# Altium project CGRA_Board_2.PrjPcb (part 3 of 3)

## Sheet TPSM846C23_template.SchDoc
size B; Organization: Altium Limited; Address1: L3, 12a Rodborough Rd; Address2: Frenchs Forest; Address3: NSW; Address4: Australia 2086
Used 2 times, as channels U_Power_subsystem/U_TPSM846C23_template, U_Power_subsystem/U_TPSM846C23_template. Parts and nets are listed once, with the designators drawn on the sheet.
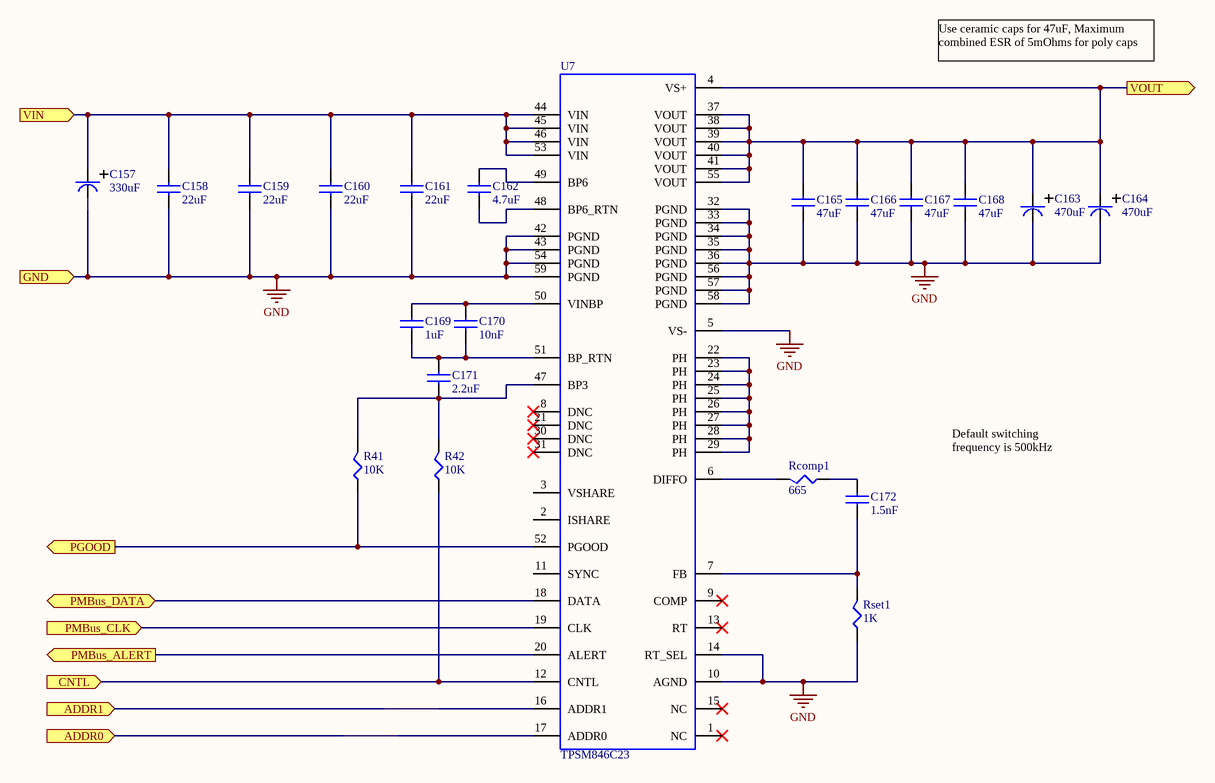
[diagram p11: TPSM846C23_template.SchDoc]

### Parts
C157  Capacitance: 330uF  [CAPAE110103X127M]  (hidden comment: CAP_POLY_330uF_25V)
C158  Capacitance: 22uF  [CAPC4532X28N]  (hidden comment: CAP_22uF_1812_25V)
C159  Capacitance: 22uF  [CAPC4532X28N]  (hidden comment: CAP_22uF_1812_25V)
C160  Capacitance: 22uF  [CAPC4532X28N]  (hidden comment: CAP_22uF_1812_25V)
C161  Capacitance: 22uF  [CAPC4532X28N]  (hidden comment: CAP_22uF_1812_25V)
C162  Capacitance: 4.7uF  [CAPC2012X14N]  (hidden comment: CAP_4.7uF_0805_25V)
C163  Capacitance: 470uF  [CAPAE110103X127M]  (hidden comment: CAP_POLY_470uF_16V)
C164  Capacitance: 470uF  [CAPAE110103X127M]  (hidden comment: CAP_POLY_470uF_16V)
C165  Capacitance: 47uF  [CAPC2012X14N]  (hidden comment: CAP_47uF_0805_10V)
C166  Capacitance: 47uF  [CAPC2012X14N]  (hidden comment: CAP_47uF_0805_10V)
C167  Capacitance: 47uF  [CAPC2012X14N]  (hidden comment: CAP_47uF_0805_10V)
C168  Capacitance: 47uF  [CAPC2012X14N]  (hidden comment: CAP_47uF_0805_10V)
C169  Capacitance: 1uF  [CAPC2012X14N]  (hidden comment: CAP_1uF_0805_25V)
C170  Capacitance: 10nF  [CAPC1005X06N]  (hidden comment: CAP_10nF_0402_25V)
C171  Capacitance: 2.2uF  [CAPC1005X06N]  (hidden comment: CAP_2.2uF_0402_25V)
C172  Capacitance: 1.5nF  [CAPC0603X02N]  (hidden comment: CAP_1500pF_0201_25V)
R41  Resistance: 10K  [RESC1608X06N]  (hidden comment: RES_10K_0603)
R42  Resistance: 10K  [RESC1608X06N]  (hidden comment: RES_10K_0603)
Rcomp1  Resistance: 665  [RESC1608X06N]  (hidden comment: RES_665_0603)
Rset1  Resistance: 1K  [RESC1608X06N]  (hidden comment: RES_1K_0603)
U7  TPSM846C23  [QFM-59]

### Ports
ADDR0 (in), ADDR1 (in), CNTL (in), GND (in), PGOOD (out), PMBus_ALERT (out), PMBus_CLK (in), PMBus_DATA (bidir), VIN (in), VOUT (out)

### Nets
GND: C157.2 C158.2 C159.2 C160.2 C161.2 C163.2 C164.2 C165.2 C166.2 C167.2 C168.2 Rset1.2 U7.5(VS-) U7.10(AGND) U7.14(RT_SEL) U7.32(PGND) U7.33(PGND) U7.34(PGND) U7.35(PGND) U7.36(PGND) U7.42(PGND) U7.43(PGND) U7.54(PGND) U7.56(PGND) U7.57(PGND) U7.58(PGND) U7.59(PGND) ; port GND
ADDR0: U7.17(ADDR0) ; port ADDR0
ADDR1: U7.16(ADDR1) ; port ADDR1
CNTL: R42.2 U7.12(CNTL) ; port CNTL
PGOOD: R41.2 U7.52(PGOOD) ; port PGOOD
PMBus_ALERT: U7.20(ALERT) ; port PMBus_ALERT
PMBus_CLK: U7.19(CLK) ; port PMBus_CLK
PMBus_DATA: U7.18(DATA) ; port PMBus_DATA
VIN: C157.1 C158.1 C159.1 C160.1 C161.1 U7.44(VIN) U7.45(VIN) U7.46(VIN) U7.53(VIN) ; port VIN
VOUT: C163.1 C164.1 C165.1 C166.1 C167.1 C168.1 U7.4(VS+) U7.37(VOUT) U7.38(VOUT) U7.39(VOUT) U7.40(VOUT) U7.41(VOUT) U7.55(VOUT) ; port VOUT
NetC162_1: C162.1 U7.49(BP6)
NetC162_2: C162.2 U7.48(BP6_RTN)
NetC169_1: C169.1 C170.1 U7.50(VINBP)
NetC169_2: C169.2 C170.2 C171.1 U7.51(BP_RTN)
NetC171_2: C171.2 R41.1 R42.1 U7.47(BP3)
NetC172_1: C172.1 Rcomp1.2
NetC172_2: C172.2 Rset1.1 U7.7(FB)
NetRcomp1_1: Rcomp1.1 U7.6(DIFFO)
NetU7_22: U7.22(PH) U7.23(PH) U7.24(PH) U7.25(PH) U7.26(PH) U7.27(PH) U7.28(PH) U7.29(PH)

Not connected (* = marked no-connect by the designer): U7 1(NC)* 2(ISHARE) 3(VSHARE) 8(DNC)* 9(COMP)* 11(SYNC) 13(RT)* 15(NC)* 21(DNC)* 30(DNC)* 31(DNC)*

### Channels
U_Power_subsystem/U_TPSM846C23_template: designators end in _U_Power_subsystem_U_TPSM846C23_template#1; ports ADDR0=NetR34_2 ADDR1=NetR33_2 CNTL=PMBUS_CNTL GND=GND PGOOD=NetDS2_2 PMBus_ALERT=ALERT0 PMBus_CLK=PICO_MASTER_I2C_SCL PMBus_DATA=PICO_MASTER_I2C_SDA VIN=12V VOUT=0V8_INT
U_Power_subsystem/U_TPSM846C23_template: designators end in _U_Power_subsystem_U_TPSM846C23_template#2; ports ADDR0=NetR37_2 ADDR1=NetR36_2 CNTL=PMBUS_CNTL GND=GND PGOOD=NetDS3_2 PMBus_ALERT=ALERTIO PMBus_CLK=PICO_MASTER_I2C_SCL PMBus_DATA=PICO_MASTER_I2C_SDA VIN=12V VOUT=1V8_PSM_INT

### Notes on the sheet
- Use ceramic caps for 47uF, Maximum combined ESR of 5mOhms for poly caps
- Default switching frequency is 500kHz
- Title
- Size:
- Date:
- B
- Number:
- Time:
- Revision:
- Sheet
- of
- File:

### Library data of the parts
C157 = CAP_POLY_330uF_25V: SML-D12U1WT86TR-ND; Manufacturer: Panasonic; Manufacturer Part Number: 25SVF330M; Supplier 1: Digi-Key; Stock 1: 639; Pricing 1: 1=2.78, 10=2.247, 100=1.716 (USD); Supplier Part Number 1: P122120CT-ND
C158-C161 = CAP_22uF_1812_25V: CAP CER 22UF 25V X7R 1812; Manufacturer: TDK; Manufacturer Part Number: C4532X7R1E226M250KC; Dielectric Material: Ceramic; Tolerance: 20%; ComponentLink1URL: http://search.murata.co.jp/Ceramy/image/img/A01X/G101/ENG/GRM0335C1E120JA01-01.pdf; ComponentLink1Description: http://search.murata.co.jp/Ceramy/image/img/A01X/G101/ENG/GRM0335C1E120JA01-01.pdf; ComponentLink2URL: http://search.murata.co.jp/Ceramy/image/img/A01X/partnumbering_e_01.pdf; ComponentLink2Description: http://search.murata.co.jp/Ceramy/image/img/A01X/partnumbering_e_01.pdf; ComponentLink3URL: http://www1.futureelectronics.com/doc/SAMSUNG/CL03A104KQ3NNNC.pdf; ComponentLink3Description: http://www1.futureelectronics.com/doc/SAMSUNG/CL03A104KQ3NNNC.pdf; ComponentLink4URL: https://www.distrelec.biz/Web/Downloads/_e/ng/MLCC_CatalogDownload2013_ENG.pdf?mime=application%2Fpdf; ComponentLink4Description: https://www.distrelec.biz/Web/Downloads/_e/ng/MLCC_CatalogDownload2013_ENG.pdf?mime=application%2Fpdf; ComponentLink5URL: https://www.verical.com/server-webapp/html/getDatasheet?partID=355266; ComponentLink5Description: https://www.verical.com/server-webapp/html/getDatasheet?partID=355266; Supplier 1: Digi-Key; Stock 1: 5000; Pricing 1: 1=1.29, 10=0.981, 100=0.7019 (USD); Mount: Surface Mount; Case/Package: 1812; Number of Pins: 2; Weight: 0.000952oz; Case Code (Metric): 4532; Case Code (Imperial): 1812; Min Operating Temperature: -55°C; Max Operating Temperature: 125°C; Packaging: Tape and Reel; Package Quantity: 1; Termination: SMD/SMT; Voltage Rating: 25V; Voltage Rating (DC): 25V; Dielectric: X7R; Composition: Ceramic; Voltage: 25V; Length: 4.5mm; Height: 2.5mm; Width: 0.126inch; Thickness: 0.11inch; Depth: 3.2mm; Radiation Hardening: No; REACH SVHC: No SVHC; Lead Free: Lead Free; ComponentLink6URL: http://uk.rs-online.com/webdocs/1532/0900766b81532cd0.pdf; ComponentLink6Description: http://uk.rs-online.com/webdocs/1532/0900766b81532cd0.pdf; ComponentLink7URL: http://www.farnell.com/datasheets/1796654.pdf; ComponentLink7Description: http://www.farnell.com/datasheets/1796654.pdf; ComponentLink8URL: https://product.tdk.com/info/en/documents/chara_sheet/C4532X7R1E226M250KC.pdf; ComponentLink8Description: https://product.tdk.com/info/en/documents/chara_sheet/C4532X7R1E226M250KC.pdf; ComponentLink9URL: http://www.mouser.com/ds/2/400/lcc_commercial_general_en-837201.pdf; ComponentLink9Description: http://www.mouser.com/ds/2/400/lcc_commercial_general_en-837201.pdf; Supplier Part Number 1: 445-1607-1-ND
C162 = CAP_4.7uF_0805_25V: Cap Ceramic 4.7uF 25V X5R 10% SMD 0805 85C Cardboard T/R; Manufacturer: Samsung; Manufacturer Part Number: CL21A475KACLRNC; Supplier 1: Digi-Key; Stock 1: 10785; Pricing 1: 1=0.25, 10=0.171, 100=0.0867, 500=0.05932, 1000=0.05247 (USD); Mount: Surface Mount; Case/Package: 0805; Case Code (Metric): 2012; Case Code (Imperial): 0805; Min Operating Temperature: -55°C; Max Operating Temperature: 85°C; Package Quantity: 1; Packaging: Tape and Reel; Tolerance: 10%; Voltage Rating: 25V; Dielectric: X5R; Length: 2mm; Height: 0.85mm; Width: 0.049inch; Thickness: 0.037inch; Depth: 1.25mm; Radiation Hardening: No; ComponentLink1URL: http://www.samsungsem.com/kr/support/product-search/mlcc/CL21A475KACLRNC.jsp; ComponentLink1Description: http://www.samsungsem.com/kr/support/product-search/mlcc/CL21A475KACLRNC.jsp; Supplier Part Number 1: 1276-2415-1-ND
C163 C164 = CAP_POLY_470uF_16V: CAP POLYMER 470UF 20% 16V SMD; Manufacturer: Panasonic; Manufacturer Part Number: 25SVF330M; ESR (Equivalent Series Resistance): 10mR; Ripple Current: 6.1A; Leakage Current: 1.504mA; Polarity: Polar; Life (Hours): 2000Hour; Dissipation Factor: 12%; Supplier 1: Digi-Key; Stock 1: 6872; Pricing 1: 1=2.66, 10=2.147, 100=1.6399 (USD); Mount: Surface Mount; Case/Package: Radial; Number of Pins: 12; Min Operating Temperature: -55°C; Max Operating Temperature: 105°C; Tolerance: 20%; Packaging: Tape and Reel; Voltage Rating: 16V; Voltage Rating (DC): 16V; Package Quantity: 400; Ripple Current (AC): 6.1A; Termination: SMD/SMT; Voltage: 16V; Diameter: 10mm; Length: 12.6mm; Height: 12.6mm; Height - Seated (Max): 0.5inch; Radiation Hardening: No; REACH SVHC: No SVHC; Lead Free: Lead Free; ComponentLink1URL: https://www.verical.com/server-webapp/html/getDatasheet?partID=743667; ComponentLink1Description: https://www.verical.com/server-webapp/html/getDatasheet?partID=743667; ComponentLink2URL: http://www.farnell.com/datasheets/1734359.pdf; ComponentLink2Description: http://www.farnell.com/datasheets/1734359.pdf; ComponentLink3URL: http://www.farnell.com/datasheets/2059644.pdf; ComponentLink3Description: http://www.farnell.com/datasheets/2059644.pdf; Supplier Part Number 1: P16477CT-ND
C165-C168 = CAP_47uF_0805_10V: Cap Ceramic 47uF 10V X5R 20% SMD 0805 85C Embossed T/R; Manufacturer: Murata; Manufacturer Part Number: GRM21BR61A476ME15L; Dissipation Factor: 0.035%; ComponentLink1URL: http://www.samsungsem.com/kr/support/product-search/mlcc/CL21A475KACLRNC.jsp; ComponentLink1Description: http://www.samsungsem.com/kr/support/product-search/mlcc/CL21A475KACLRNC.jsp; ComponentLink2URL: http://capacitoredge.kemet.com/capedge2/DataSheet?pn=C0805C105K3RAC7800; ComponentLink2Description: http://capacitoredge.kemet.com/capedge2/DataSheet?pn=C0805C105K3RAC7800; Supplier 1: Digi-Key; Stock 1: 30000; Pricing 1: 1=0.93, 10=0.687, 100=0.4713, 500=0.37308, 1000=0.31418 (USD); Mount: Surface Mount; Case/Package: 0805; Case Code (Metric): 2012; Case Code (Imperial): 0805; Dielectric Material: Ceramic; Min Operating Temperature: -55°C; Max Operating Temperature: 85°C; Tolerance: 20%; Packaging: Tape and Reel; Dielectric: X5R; Voltage Rating: 10V; Voltage: 10V; Termination: SMD/SMT; Voltage Rating (DC): 10V; Length: 2mm; Height: 1.25mm; Width: 0.049inch; Thickness: 0.057inch; Depth: 1.25mm; REACH SVHC: No SVHC; Lead Free: Lead Free; Supplier Part Number 1: 490-9961-1-ND
C169 = CAP_1uF_0805_25V: CAP CER 1UF 25V X7R 0805; Manufacturer: Yageo; Manufacturer Part Number: CC0805KKX7R8BB105; Tolerance: 10%; Dissipation Factor: 5%; ComponentLink1URL: http://www.samsungsem.com/kr/support/product-search/mlcc/CL21A475KACLRNC.jsp; ComponentLink1Description: http://www.samsungsem.com/kr/support/product-search/mlcc/CL21A475KACLRNC.jsp; Supplier 1: Digi-Key; Stock 1: 30000; Pricing 1: 1=0.33, 10=0.226, 100=0.1145, 500=0.07832, 1000=0.06928 (USD); Mount: Surface Mount; Case/Package: 0805; Min Operating Temperature: -55°C; Max Operating Temperature: 125°C; Packaging: Tape and Reel; Dielectric: X7R; Termination: SMD/SMT; Length: 2mm; Radiation Hardening: No; ComponentLink2URL: http://capacitoredge.kemet.com/capedge2/DataSheet?pn=C0805C105K3RAC7800; ComponentLink2Description: http://capacitoredge.kemet.com/capedge2/DataSheet?pn=C0805C105K3RAC7800; Supplier Part Number 1: 311-1456-1-ND; Case Code (Metric): 2012; Case Code (Imperial): 0805; Package Quantity: 3000; Voltage Rating: 25V; Voltage Rating (DC): 25V; Width: 0.049inch; Thickness: 0.057inch; REACH SVHC: No SVHC; Number of Pins: 2; Composition: Ceramic; Height: 1.25mm; Depth: 1.25mm; Lead Free: Lead Free; Halogen Free: Halogen Free; ComponentLink3URL: http://www.yageo.com/documents/recent/UPY-GPHC_X7R_6.3V-to-50V_18.pdf; ComponentLink3Description: http://www.yageo.com/documents/recent/UPY-GPHC_X7R_6.3V-to-50V_18.pdf; ComponentLink4URL: http://www.mouser.com/ds/2/447/Yageo_UPY-GP_NP0_16V-to-50V_9-358835.pdf; ComponentLink4Description: http://www.mouser.com/ds/2/447/Yageo_UPY-GP_NP0_16V-to-50V_9-358835.pdf; ComponentLink5URL: http://www.yageo.com/documents/recent/UPY-GPHC_X7R_6.3V-to-50V_8.pdf; ComponentLink5Description: http://www.yageo.com/documents/recent/UPY-GPHC_X7R_6.3V-to-50V_8.pdf; ComponentLink6URL: http://www.farnell.com/datasheets/1489800.pdf; ComponentLink6Description: http://www.farnell.com/datasheets/1489800.pdf
C170 = CAP_10nF_0402_25V: CAP CER 10000PF 50V X7R 0402; Manufacturer: Murata; Manufacturer Part Number: GCM155R71H103KA55D; Tolerance: 10%; ComponentLink1URL: http://search.murata.co.jp/Ceramy/image/img/A01X/G101/ENG/GRM0335C1E120JA01-01.pdf; ComponentLink1Description: http://search.murata.co.jp/Ceramy/image/img/A01X/G101/ENG/GRM0335C1E120JA01-01.pdf; ComponentLink2URL: http://search.murata.co.jp/Ceramy/image/img/A01X/partnumbering_e_01.pdf; ComponentLink2Description: http://search.murata.co.jp/Ceramy/image/img/A01X/partnumbering_e_01.pdf; ComponentLink3URL: http://www1.futureelectronics.com/doc/SAMSUNG/CL03A104KQ3NNNC.pdf; ComponentLink3Description: http://www1.futureelectronics.com/doc/SAMSUNG/CL03A104KQ3NNNC.pdf; ComponentLink4URL: https://www.distrelec.biz/Web/Downloads/_e/ng/MLCC_CatalogDownload2013_ENG.pdf?mime=application%2Fpdf; ComponentLink4Description: https://www.distrelec.biz/Web/Downloads/_e/ng/MLCC_CatalogDownload2013_ENG.pdf?mime=application%2Fpdf; ComponentLink5URL: https://www.verical.com/server-webapp/html/getDatasheet?partID=355266; ComponentLink5Description: https://www.verical.com/server-webapp/html/getDatasheet?partID=355266; Supplier 1: Digi-Key; Stock 1: 100000; Pricing 1: 1=0.1, 10=0.048, 100=0.0215, 500=0.01538, 1000=0.01208, 2500=0.01098, 5000=0.0101 (USD); Mount: Surface Mount; Case/Package: 0402; Case Code (Imperial): 0402; Case Code (Metric): 1005; Min Operating Temperature: -55°C; Max Operating Temperature: 125°C; Voltage Rating: 50V; Packaging: Tape and Reel; Package Quantity: 1; Dielectric: X7R; Termination: SMD/SMT; Voltage: 50V; Voltage Rating (DC): 50V; Length: 1mm; Height: 0.5mm; Width: 0.02inch; Thickness: 0.022inch; Depth: 0.5mm; Ratings: AEC-Q200; Radiation Hardening: No; REACH SVHC: No SVHC; Lead Free: Lead Free; ComponentLink6URL: http://psearch.murata.com/capacitor/product/GCM155R71H103KA55%23.pdf; ComponentLink6Description: http://psearch.murata.com/capacitor/product/GCM155R71H103KA55%23.pdf; ComponentLink7URL: https://www.verical.com/server-webapp/html/getDatasheet?partID=27433; ComponentLink7Description: https://www.verical.com/server-webapp/html/getDatasheet?partID=27433; ComponentLink8URL: http://psearch.en.murata.com/capacitor/product/GCM155R71H103KA55%23.pdf; ComponentLink8Description: http://psearch.en.murata.com/capacitor/product/GCM155R71H103KA55%23.pdf; ComponentLink9URL: http://search.murata.co.jp/Ceramy/image/img/A01X/partnumbering_e_02.pdf; ComponentLink9Description: http://search.murata.co.jp/Ceramy/image/img/A01X/partnumbering_e_02.pdf; ComponentLink10URL: http://uk.rs-online.com/webdocs/0ef9/0900766b80ef92d0.pdf; ComponentLink10Description: http://uk.rs-online.com/webdocs/0ef9/0900766b80ef92d0.pdf; Supplier Part Number 1: 490-4762-1-ND
C171 = CAP_2.2uF_0402_25V: Multilayer Ceramic Capacitors MLCC - SMD/SMT 0402 2.2uF 25volts *Derate Voltage/Temp; Manufacturer: Murata; Manufacturer Part Number: GRM155R61E225ME15D; Voltage Rating: 25V; Tolerance: 20%; Dielectric: X5R; ComponentLink1URL: http://search.murata.co.jp/Ceramy/image/img/A01X/G101/ENG/GRM0335C1E120JA01-01.pdf; ComponentLink1Description: http://search.murata.co.jp/Ceramy/image/img/A01X/G101/ENG/GRM0335C1E120JA01-01.pdf; ComponentLink2URL: http://search.murata.co.jp/Ceramy/image/img/A01X/partnumbering_e_01.pdf; ComponentLink2Description: http://search.murata.co.jp/Ceramy/image/img/A01X/partnumbering_e_01.pdf; ComponentLink3URL: http://www1.futureelectronics.com/doc/SAMSUNG/CL03A104KQ3NNNC.pdf; ComponentLink3Description: http://www1.futureelectronics.com/doc/SAMSUNG/CL03A104KQ3NNNC.pdf; ComponentLink4URL: https://www.distrelec.biz/Web/Downloads/_e/ng/MLCC_CatalogDownload2013_ENG.pdf?mime=application%2Fpdf; ComponentLink4Description: https://www.distrelec.biz/Web/Downloads/_e/ng/MLCC_CatalogDownload2013_ENG.pdf?mime=application%2Fpdf; ComponentLink5URL: https://www.verical.com/server-webapp/html/getDatasheet?partID=355266; ComponentLink5Description: https://www.verical.com/server-webapp/html/getDatasheet?partID=355266; ComponentLink6URL: http://psearch.murata.com/capacitor/product/GCM155R71H103KA55%23.pdf; ComponentLink6Description: http://psearch.murata.com/capacitor/product/GCM155R71H103KA55%23.pdf; ComponentLink7URL: https://www.verical.com/server-webapp/html/getDatasheet?partID=27433; ComponentLink7Description: https://www.verical.com/server-webapp/html/getDatasheet?partID=27433; ComponentLink8URL: http://psearch.en.murata.com/capacitor/product/GCM155R71H103KA55%23.pdf; ComponentLink8Description: http://psearch.en.murata.com/capacitor/product/GCM155R71H103KA55%23.pdf; ComponentLink9URL: http://search.murata.co.jp/Ceramy/image/img/A01X/partnumbering_e_02.pdf; ComponentLink9Description: http://search.murata.co.jp/Ceramy/image/img/A01X/partnumbering_e_02.pdf; ComponentLink10URL: http://uk.rs-online.com/webdocs/0ef9/0900766b80ef92d0.pdf; ComponentLink10Description: http://uk.rs-online.com/webdocs/0ef9/0900766b80ef92d0.pdf; Supplier 1: Digi-Key; Stock 1: 100000; Pricing 1: 1=0.34, 10=0.23, 100=0.1163, 500=0.0796, 1000=0.07041, 2500=0.06735, 5000=0.06123 (USD); Mount: Surface Mount; Case/Package: 0402; Weight: 0.000212oz; Case Code (Metric): 1005; Case Code (Imperial): 0402; Min Operating Temperature: -55°C; Max Operating Temperature: 85°C; Packaging: Tape and Reel; Termination: SMD/SMT; Voltage Rating (DC): 25V; Package Quantity: 10000; Length: 0.039inch; Height: 0.5mm; Width: 0.02inch; Thickness: 0.022inch; Supplier Part Number 1: 490-10457-1-ND
C172 = CAP_1500pF_0201_25V: Multilayer Ceramic Capacitors MLCC - SMD/SMT 0.0015uF 25Volts 10%; Manufacturer: Murata; Manufacturer Part Number: GCM033R71E152KA03D; Voltage Rating: 25V; Dielectric: X7R; ComponentLink1URL: http://search.murata.co.jp/Ceramy/image/img/A01X/G101/ENG/GRM0335C1E120JA01-01.pdf; ComponentLink1Description: http://search.murata.co.jp/Ceramy/image/img/A01X/G101/ENG/GRM0335C1E120JA01-01.pdf; ComponentLink2URL: http://search.murata.co.jp/Ceramy/image/img/A01X/partnumbering_e_01.pdf; ComponentLink2Description: http://search.murata.co.jp/Ceramy/image/img/A01X/partnumbering_e_01.pdf; Supplier 1: Digi-Key; Stock 1: 27534; Pricing 1: 1=0.1, 10=0.048, 100=0.0216, 500=0.01542, 1000=0.01211, 2500=0.01101, 5000=0.01013 (USD); Mount: Surface Mount; Case/Package: 0201; Case Code (Metric): 0603; Case Code (Imperial): 0201; Min Operating Temperature: -55°C; Max Operating Temperature: 125°C; Package Quantity: 15000; Packaging: Tape and Reel; Tolerance: 10%; Voltage Rating (DC): 25V; Termination: SMD/SMT; Length: 0.6mm; Height: 0.3mm; Width: 0.012inch; Thickness: 0.013inch; Depth: 0.3mm; Ratings: AEC-Q200; Radiation Hardening: No; ComponentLink3URL: http://search.murata.co.jp/Ceramy/image/img/A01X/partnumbering_e_02.pdf; ComponentLink3Description: http://search.murata.co.jp/Ceramy/image/img/A01X/partnumbering_e_02.pdf; ComponentLink4URL: http://psearch.murata.com/capacitor/product/GCM033R71E152KA03%23.pdf; ComponentLink4Description: http://psearch.murata.com/capacitor/product/GCM033R71E152KA03%23.pdf; ComponentLink5URL: https://www.murata.com/~/media/webrenewal/support/library/catalog/products/capacitor/mlcc/c03e.ashx?la=en-us; ComponentLink5Description: https://www.murata.com/~/media/webrenewal/support/library/catalog/products/capacitor/mlcc/c03e.ashx?la=en-us; Supplier Part Number 1: 490-7996-1-ND
R41 R42 = RES_10K_0603: RES SMD 10K OHM 1% 1/4W 0603; Manufacturer: Rohm; Manufacturer Part Number: ESR03EZPF1002; Power Rating: 250mW; Temperature Coefficient: 100ppm/°C; Supplier 1: Digi-Key; Stock 1: 273579; Pricing 1: 1=0.14, 10=0.126, 100=0.0484, 1000=0.0213, 2500=0.01839 (USD); Case/Package: 0603; Case Code (Metric): 1608; Case Code (Imperial): 0603; Min Operating Temperature: -55°C; Max Operating Temperature: 155°C; Tolerance: 1%; Package Quantity: 1; Packaging: Tape and Reel; Composition: Thick Film; Number of Terminations: 2; Max Power Dissipation: 250mW; Features: Automotive AEC-Q200; Length: 0.063inch; Height: 0.022inch; Width: 0.031inch; Lead Free: Lead Free; ComponentLink1URL: https://www.rohm.com/datasheet/ESR01MZPF/esr-e; ComponentLink1Description: https://www.rohm.com/datasheet/ESR01MZPF/esr-e; Supplier Part Number 1: P10.0KHCT-ND
Rcomp1 = RES_665_0603: RESISTOR, 665R, 0603, 0.1%, 0.1W; Manufacturer: Panasonic; Manufacturer Part Number: ERA3AEB6650V; Power Rating: 100mW; Voltage Rating: 75V; Temperature Coefficient: 25ppm/°C; ComponentLink1URL: https://www.rohm.com/datasheet/ESR01MZPF/esr-e; ComponentLink1Description: https://www.rohm.com/datasheet/ESR01MZPF/esr-e; Supplier 1: Digi-Key; Stock 1: 9157; Pricing 1: 1=0.35, 10=0.3, 100=0.1172, 1000=0.04906, 2500=0.04498 (USD); Mount: Surface Mount; Case/Package: 0603; Number of Pins: 2; Case Code (Imperial): 0603; Case Code (Metric): 1608; Contact Plating: Tin; Min Operating Temperature: -55°C; Max Operating Temperature: 155°C; Tolerance: 0.1%; Packaging: Tape and Reel; Package Quantity: 1; Composition: Metal Film,Thin Film; Number of Terminations: 2; Max Power Dissipation: 100mW; Voltage Rating (DC): 75V; Features: Automotive AEC-Q200; Military Standard: Not; Length: 1.6mm; Height: 0.45mm; Width: 0.8mm; Depth: 0.8mm; Radiation Hardening: No; Lead Free: Lead Free; ComponentLink2URL: http://www.farnell.com/datasheets/485442.pdf; ComponentLink2Description: http://www.farnell.com/datasheets/485442.pdf; ComponentLink3URL: http://industrial.panasonic.com/www-data/pdf/AOA0000/AOA0000CE26.pdf; ComponentLink3Description: http://industrial.panasonic.com/www-data/pdf/AOA0000/AOA0000CE26.pdf; ComponentLink4URL: http://uk.rs-online.com/webdocs/0eb1/0900766b80eb1d8c.pdf; ComponentLink4Description: http://uk.rs-online.com/webdocs/0eb1/0900766b80eb1d8c.pdf; Supplier Part Number 1: P665DBCT-ND
Rset1 = RES_1K_0603: RES SMD 1K OHM 5% 1/4W 0603; Manufacturer: Rohm; Manufacturer Part Number: ESR03EZPJ102; Temperature Coefficient: 200ppm/°C; Max Power Dissipation: 250mW; ComponentLink1URL: https://www.rohm.com/datasheet/ESR01MZPF/esr-e; ComponentLink1Description: https://www.rohm.com/datasheet/ESR01MZPF/esr-e; Supplier 1: Digi-Key; Stock 1: 381742; Pricing 1: 1=0.1, 10=0.087, 100=0.0333, 1000=0.01464, 2500=0.01264 (USD); Case/Package: 0603; Case Code (Metric): 1608; Case Code (Imperial): 0603; Min Operating Temperature: -55°C; Max Operating Temperature: 155°C; Tolerance: 5%; Package Quantity: 1; Packaging: Tape and Reel; Composition: Thick Film; Number of Terminations: 2; Features: Automotive AEC-Q200; Length: 0.063inch; Height: 0.022inch; Width: 0.031inch; Lead Free: Lead Free; Supplier Part Number 1: RHM1.0KDCT-ND
U7 = TPSM846C23: Non-Isolated PoL Module DC DC Converter 1 Output 0.35 ~ 2V 35A 4.5V - 15V Input; Manufacturer: Texas Instruments; Manufacturer Part Number: TPSM846C23MOLR; Supplier 1: Digi-Key; Stock 1: 323; Pricing 1: 1=24.49, 10=22.587, 100=19.2882 (USD); Min Operating Temperature: -40°C; Max Operating Temperature: 105°C; Supplier Part Number 1: 296-48350-1-ND

## Sheet CSI_connectors.SchDoc
size B
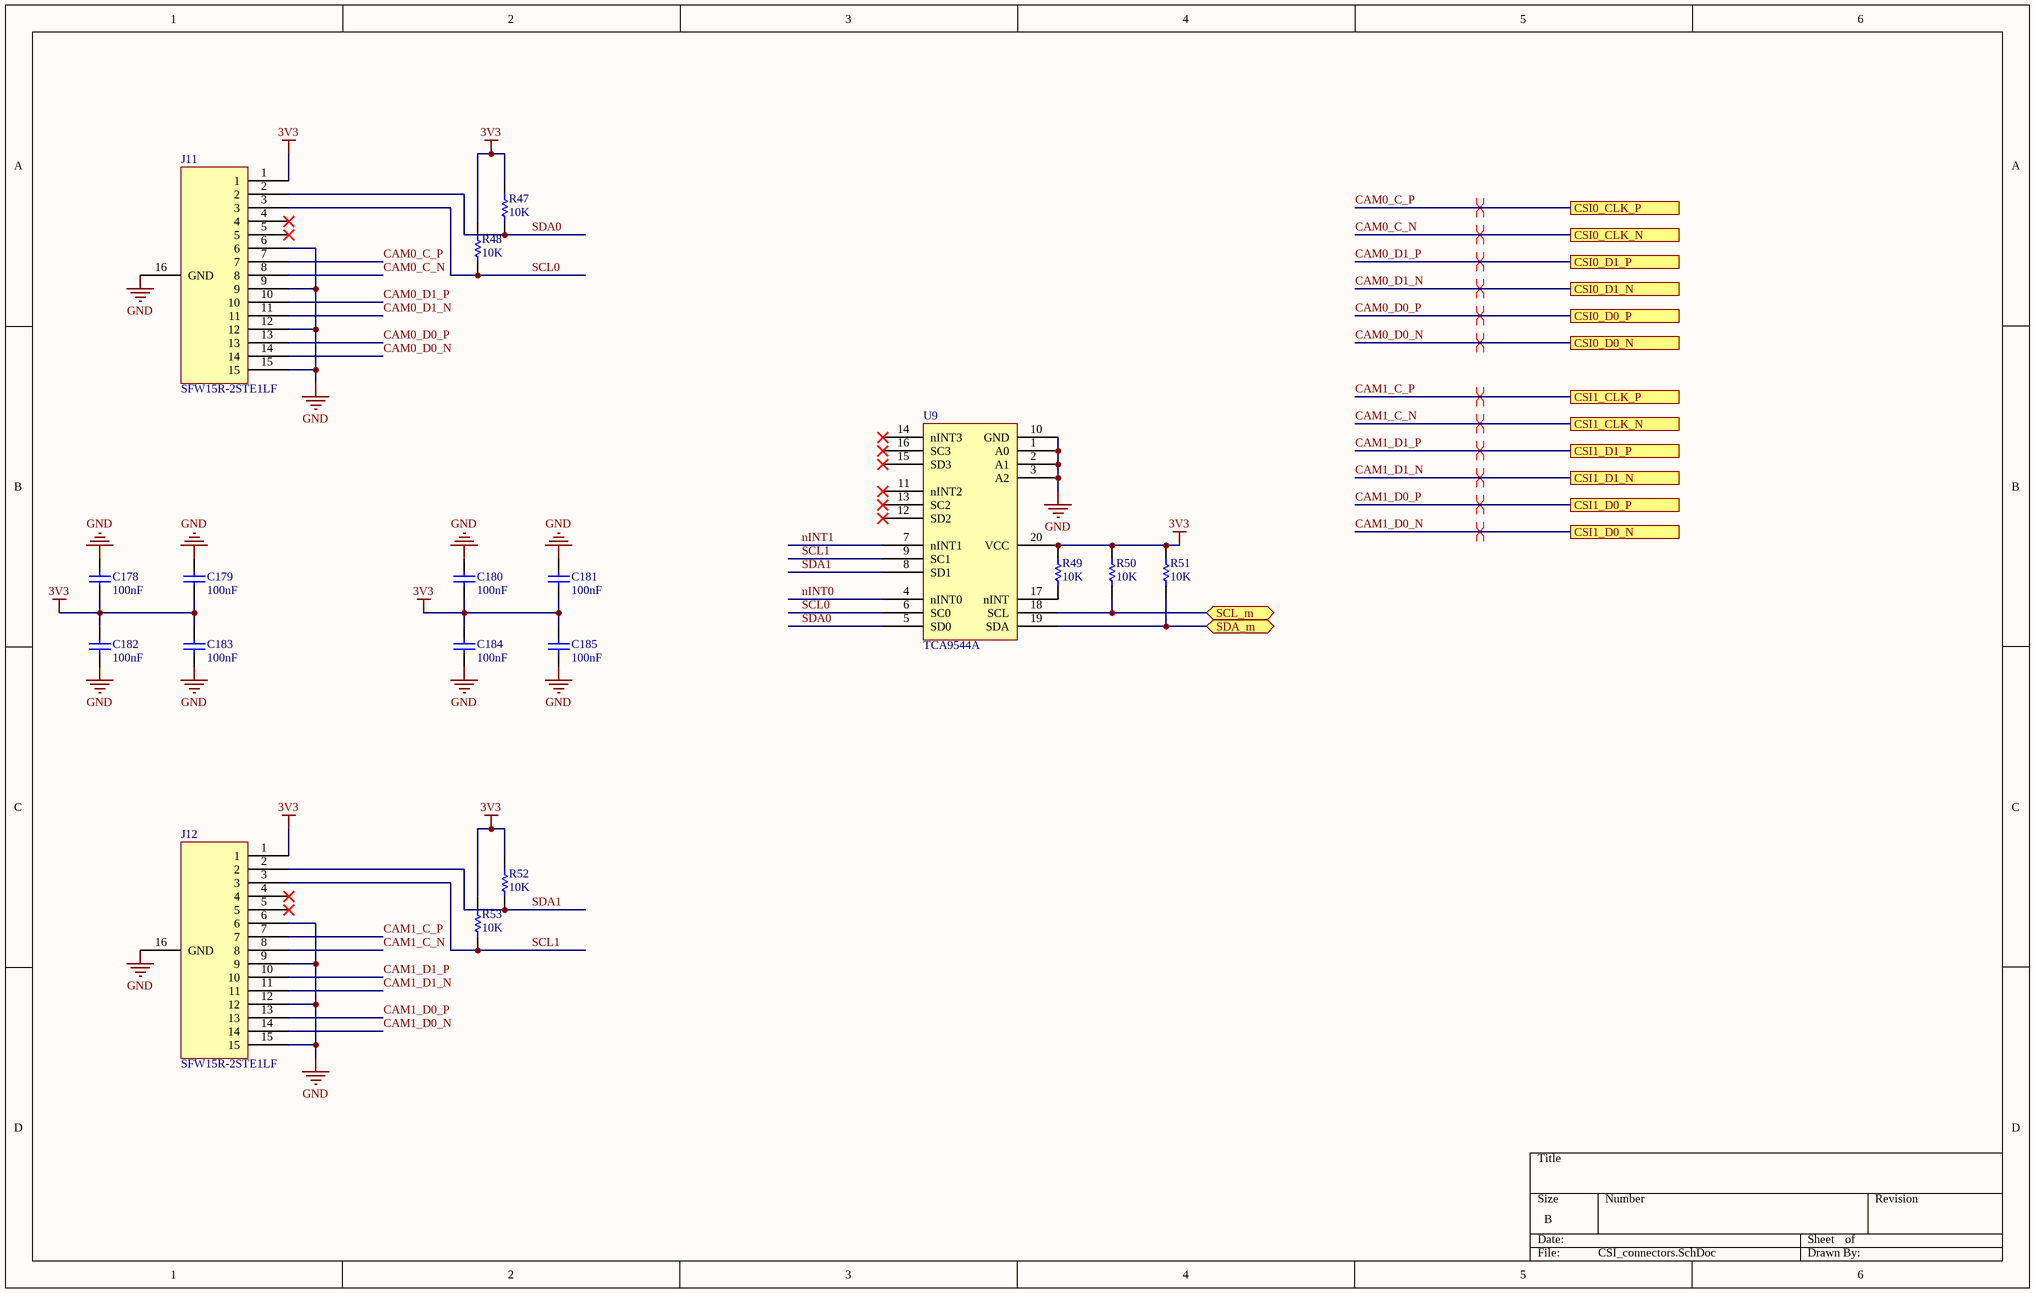
[diagram p12: CSI_connectors.SchDoc]

### Parts
C178  100nF  [CAPC0603(1608)100_N]
C179  100nF  [CAPC0603(1608)100_N]
C180  100nF  [CAPC0603(1608)100_N]
C181  100nF  [CAPC0603(1608)100_N]
C182  100nF  [CAPC0603(1608)100_N]
C183  100nF  [CAPC0603(1608)100_N]
C184  100nF  [CAPC0603(1608)100_N]
C185  100nF  [CAPC0603(1608)100_N]
J11  SFW15R-2STE1LF  [SFW15R-2STE1LF]
J12  SFW15R-2STE1LF  [SFW15R-2STE1LF]
R47  10K  [RESC0603(1608)_N]
R48  10K  [RESC0603(1608)_N]
R49  10K  [RESC0603(1608)_N]
R50  10K  [RESC0603(1608)_N]
R51  10K  [RESC0603(1608)_N]
R52  10K  [RESC0603(1608)_N]
R53  10K  [RESC0603(1608)_N]
U9  TCA9544A  [TSOP65P640X120-20N]

### Ports
CSI0_CLK_N, CSI0_CLK_P, CSI0_D0_N, CSI0_D0_P, CSI0_D1_N, CSI0_D1_P, CSI1_CLK_N, CSI1_CLK_P, CSI1_D0_N, CSI1_D0_P, CSI1_D1_N, CSI1_D1_P, SCL_m (bidir), SDA_m (bidir)

### Nets
3V3: C178.1 C179.1 C180.1 C181.1 C182.2 C183.2 C184.2 C185.2 J11.1 J12.1 R47.2 R48.2 R49.2 R50.2 R51.2 R52.2 R53.2 U9.20(VCC)
GND: C178.2 C179.2 C180.2 C181.2 C182.1 C183.1 C184.1 C185.1 J11.6 J11.9 J11.12 J11.15 J11.16(GND) J12.6 J12.9 J12.12 J12.15 J12.16(GND) U9.1(A0) U9.2(A1) U9.3(A2) U9.10(GND)
CAM0_C_N: J11.8 ; port CSI0_CLK_N
CAM0_C_P: J11.7 ; port CSI0_CLK_P
CAM0_D0_N: J11.14 ; port CSI0_D0_N
CAM0_D0_P: J11.13 ; port CSI0_D0_P
CAM0_D1_N: J11.11 ; port CSI0_D1_N
CAM0_D1_P: J11.10 ; port CSI0_D1_P
CAM1_C_N: J12.8 ; port CSI1_CLK_N
CAM1_C_P: J12.7 ; port CSI1_CLK_P
CAM1_D0_N: J12.14 ; port CSI1_D0_N
CAM1_D0_P: J12.13 ; port CSI1_D0_P
CAM1_D1_N: J12.11 ; port CSI1_D1_N
CAM1_D1_P: J12.10 ; port CSI1_D1_P
HDR_PICO_I2C_SCL: R50.1 U9.18(SCL) ; port SCL_m
HDR_PICO_I2C_SDA: R51.1 U9.19(SDA) ; port SDA_m
nINT0: U9.4(nINT0)
nINT1: U9.7(nINT1)
SCL0: J11.3 R48.1 U9.6(SC0)
SCL1: J12.3 R53.1 U9.9(SC1)
SDA0: J11.2 R47.1 U9.5(SD0)
SDA1: J12.2 R52.1 U9.8(SD1)
NetR49_1: R49.1 U9.17(nINT)

Not connected (* = marked no-connect by the designer): J11 4* 5*; J12 4* 5*; U9 11(nINT2)* 12(SD2)* 13(SC2)* 14(nINT3)* 15(SD3)* 16(SC3)*

### Layout directives
differential pair: CAM0_C_N, CAM0_C_P, CAM0_D0_N, CAM0_D0_P, CAM0_D1_N, CAM0_D1_P, CAM1_C_N, CAM1_C_P, CAM1_D0_N, CAM1_D0_P, CAM1_D1_N, CAM1_D1_P

### Library data of the parts
C178-C185 = CAP_0603: 100nF 10V; Value: 1uF; Rated Voltage: 50 V; Case-EIA: 0603; Case-Metric: 1608; Tolerance: Â±10%; Technology: SMT; Max Thickness: 1 mm
R47-R53 = CMP-1012-00623-1: 10K 0.1W 1% 0603 (1608 Metric)  SMD; Value: 10000.00 Ohm; Case-EIA: 0603; Case-Metric: 1608; Power: 0.1 W; Tolerance: 1 %; Technology: SMT
U9 = TCA9544A: Low Voltage 4-Channel I / 2C and SMBus Multiplexer With Interrupt Logic

## Sheet Ref_CLK.SchDoc
size B; Organization: Altium Limited; Address1: L3, 12a Rodborough Rd; Address2: Frenchs Forest; Address3: NSW; Address4: Australia 2086
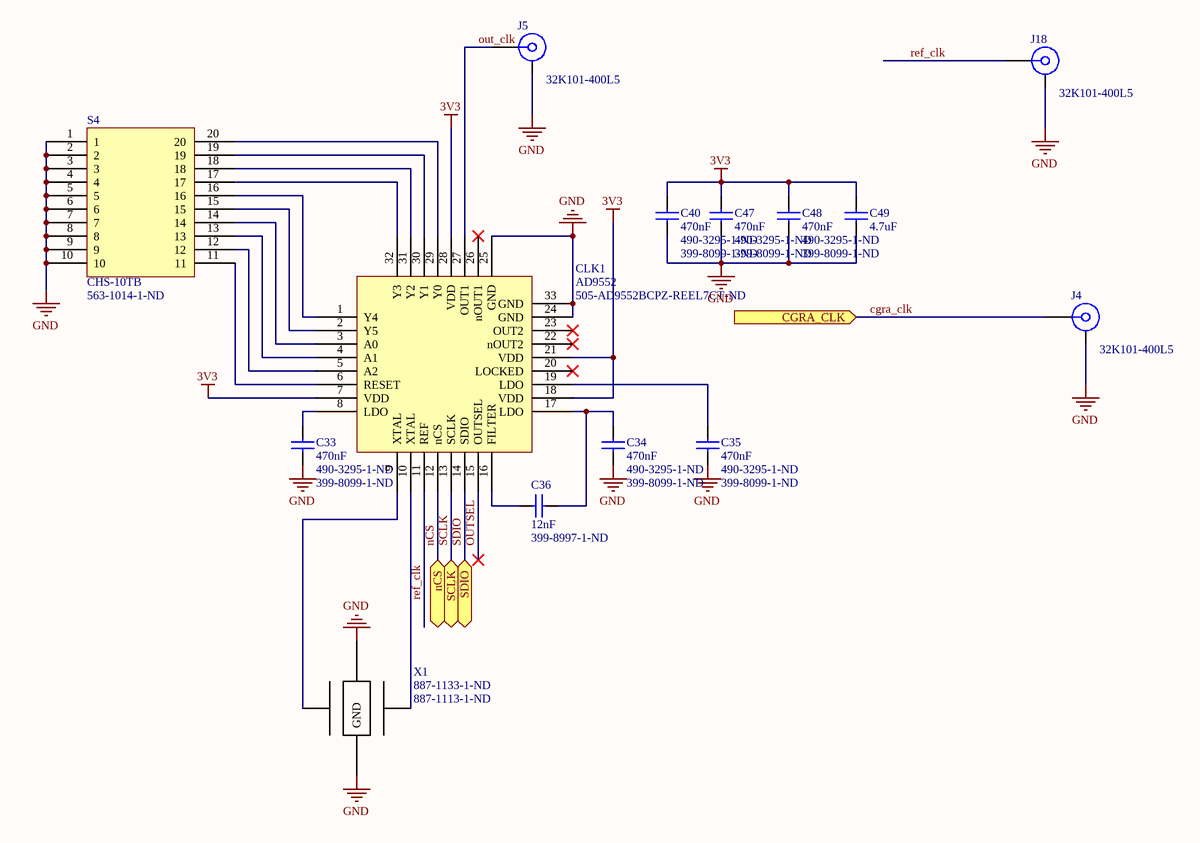
[diagram p13: Ref_CLK.SchDoc]

### Parts
C33  Capacitance: 470nF  Supplier Part Number 1: 490-3295-1-ND  Supplier Part Number 2: 399-8099-1-ND  [CAPC1005X06N]  (hidden comment: CAP_470nF_1608mm_0603mil_1)
C34  Capacitance: 470nF  Supplier Part Number 1: 490-3295-1-ND  Supplier Part Number 2: 399-8099-1-ND  [CAPC1005X06N]  (hidden comment: CAP_470nF_1608mm_0603mil_1)
C35  Capacitance: 470nF  Supplier Part Number 1: 490-3295-1-ND  Supplier Part Number 2: 399-8099-1-ND  [CAPC1005X06N]  (hidden comment: CAP_470nF_1608mm_0603mil_1)
C36  Capacitance: 12nF  Supplier Part Number 1: 399-8997-1-ND  [CAPC1005X06N]  (hidden comment: CAP_12nF_1608mm_0603mil)
C40  Capacitance: 470nF  Supplier Part Number 1: 490-3295-1-ND  Supplier Part Number 2: 399-8099-1-ND  [CAPC1005X06N]  (hidden comment: CAP_470nF_1608mm_0603mil_1)
C47  Capacitance: 470nF  Supplier Part Number 1: 490-3295-1-ND  Supplier Part Number 2: 399-8099-1-ND  [CAPC1005X06N]  (hidden comment: CAP_470nF_1608mm_0603mil_1)
C48  Capacitance: 470nF  Supplier Part Number 1: 490-3295-1-ND  Supplier Part Number 2: 399-8099-1-ND  [CAPC1005X06N]  (hidden comment: CAP_470nF_1608mm_0603mil_1)
C49  Capacitance: 4.7uF  [CAPC2012X14N]  (hidden comment: CAP_4.7uF_0805_25V)
CLK1  AD9552  Supplier Part Number 1: 505-AD9552BCPZ-REEL7CT-ND  [QFN50P500X500X80_HS-33N]
J4  32K101-400L5  [ROS-32K101-400L5_V]
J5  32K101-400L5  [ROS-32K101-400L5_V]
J18  32K101-400L5  [ROS-32K101-400L5_V]
S4  CHS-10TB  Supplier Part Number 1: 563-1014-1-ND  [SOIC127P800X250-20N]
X1  Supplier Part Number 1: 887-1133-1-ND  Supplier Part Number 2: 887-1113-1-ND  [7M-26.000MAAJ-T footprint]  (hidden comment: XTAL)

### Ports
CGRA_CLK (in), nCS (bidir), SCLK (bidir), SDIO (bidir)

### Nets
3V3: C40.1 C47.1 C48.1 C49.1 CLK1.7(VDD) CLK1.18(VDD) CLK1.21(VDD) CLK1.28(VDD)
GND: C33.2 C34.2 C35.2 C40.2 C47.2 C48.2 C49.2 CLK1.24(GND) CLK1.25(GND) CLK1.33(GND) J4.MH J5.MH J18.MH S4.1 S4.2 S4.3 S4.4 S4.5 S4.6 S4.7 S4.8 S4.9 S4.10 X1.2 X1.4(GND)
cgra_clk: J4.1 ; port CGRA_CLK
nCS: CLK1.12(nCS) ; port nCS
out_clk: CLK1.27(OUT1) J5.1
OUTSEL: CLK1.15(OUTSEL)
ref_clk: CLK1.11(REF) J18.1
SCLK: CLK1.13(SCLK) ; port SCLK  [project net PICO_SPI1_SCK]
SDIO: CLK1.14(SDIO) ; port SDIO  [project net PICO_SPI1_TX]
NetC33_1: C33.1 CLK1.8(LDO)
NetC34_1: C34.1 C36.2 CLK1.17(LDO)
NetC35_1: C35.1 CLK1.19(LDO)
NetC36_1: C36.1 CLK1.16(FILTER)
NetCLK1_1: CLK1.1(Y4) S4.16
NetCLK1_2: CLK1.2(Y5) S4.15
NetCLK1_3: CLK1.3(A0) S4.14
NetCLK1_4: CLK1.4(A1) S4.13
NetCLK1_5: CLK1.5(A2) S4.12
NetCLK1_6: CLK1.6(RESET) S4.11
NetCLK1_9: CLK1.9(XTAL) X1.1(XO)
NetCLK1_10: CLK1.10(XTAL) X1.3(XI)
NetCLK1_29: CLK1.29(Y0) S4.20
NetCLK1_30: CLK1.30(Y1) S4.19
NetCLK1_31: CLK1.31(Y2) S4.18
NetCLK1_32: CLK1.32(Y3) S4.17

Not connected (* = marked no-connect by the designer): CLK1 20(LOCKED)* 22(nOUT2)* 23(OUT2)* 26(nOUT1)*

### Notes on the sheet
- Title
- Size:
- Date:
- B
- Number:
- Time:
- Revision:
- Sheet
- of
- File:

### Library data of the parts
C33-C35 C40 C47 C48 = CAP_470nF_1608mm_0603mil_1: 0.47uF Capacitor; Manufacturer: Murata; Manufacturer Part Number: GRM155R61E225ME15D; Voltage Rating: 25V; Tolerance: 20%; Dielectric: X5R; ComponentLink1URL: http://search.murata.co.jp/Ceramy/image/img/A01X/G101/ENG/GRM0335C1E120JA01-01.pdf; ComponentLink1Description: http://search.murata.co.jp/Ceramy/image/img/A01X/G101/ENG/GRM0335C1E120JA01-01.pdf; ComponentLink2URL: http://search.murata.co.jp/Ceramy/image/img/A01X/partnumbering_e_01.pdf; ComponentLink2Description: http://search.murata.co.jp/Ceramy/image/img/A01X/partnumbering_e_01.pdf; ComponentLink3URL: http://www1.futureelectronics.com/doc/SAMSUNG/CL03A104KQ3NNNC.pdf; ComponentLink3Description: http://www1.futureelectronics.com/doc/SAMSUNG/CL03A104KQ3NNNC.pdf; ComponentLink4URL: https://www.distrelec.biz/Web/Downloads/_e/ng/MLCC_CatalogDownload2013_ENG.pdf?mime=application%2Fpdf; ComponentLink4Description: https://www.distrelec.biz/Web/Downloads/_e/ng/MLCC_CatalogDownload2013_ENG.pdf?mime=application%2Fpdf; ComponentLink5URL: https://www.verical.com/server-webapp/html/getDatasheet?partID=355266; ComponentLink5Description: https://www.verical.com/server-webapp/html/getDatasheet?partID=355266; ComponentLink6URL: http://psearch.murata.com/capacitor/product/GCM155R71H103KA55%23.pdf; ComponentLink6Description: http://psearch.murata.com/capacitor/product/GCM155R71H103KA55%23.pdf; ComponentLink7URL: https://www.verical.com/server-webapp/html/getDatasheet?partID=27433; ComponentLink7Description: https://www.verical.com/server-webapp/html/getDatasheet?partID=27433; ComponentLink8URL: http://psearch.en.murata.com/capacitor/product/GCM155R71H103KA55%23.pdf; ComponentLink8Description: http://psearch.en.murata.com/capacitor/product/GCM155R71H103KA55%23.pdf; ComponentLink9URL: http://search.murata.co.jp/Ceramy/image/img/A01X/partnumbering_e_02.pdf; ComponentLink9Description: http://search.murata.co.jp/Ceramy/image/img/A01X/partnumbering_e_02.pdf; ComponentLink10URL: http://uk.rs-online.com/webdocs/0ef9/0900766b80ef92d0.pdf; ComponentLink10Description: http://uk.rs-online.com/webdocs/0ef9/0900766b80ef92d0.pdf; Stock 1: 100000; Pricing 1: 1=0.34, 10=0.23, 100=0.1163, 500=0.0796, 1000=0.07041, 2500=0.06735, 5000=0.06123 (USD); Mount: Surface Mount; Case/Package: 0402; Weight: 0.000212oz; Case Code (Metric): 1005; Case Code (Imperial): 0402; Min Operating Temperature: -55°C; Max Operating Temperature: 85°C; Packaging: Tape and Reel; Termination: SMD/SMT; Voltage Rating (DC): 25V; Package Quantity: 10000; Length: 0.039inch; Height: 0.5mm; Width: 0.02inch; Thickness: 0.022inch; Supplier 1: Digi-Key; Supplier 2: Digi-Key
C36 = CAP_12nF_1608mm_0603mil: Multilayer Ceramic Capacitors MLCC - SMD/SMT 0402 2.2uF 25volts *Derate Voltage/Temp; Manufacturer: Murata; Manufacturer Part Number: GRM155R61E225ME15D; Voltage Rating: 25V; Tolerance: 20%; Dielectric: X5R; ComponentLink1URL: http://search.murata.co.jp/Ceramy/image/img/A01X/G101/ENG/GRM0335C1E120JA01-01.pdf; ComponentLink1Description: http://search.murata.co.jp/Ceramy/image/img/A01X/G101/ENG/GRM0335C1E120JA01-01.pdf; ComponentLink2URL: http://search.murata.co.jp/Ceramy/image/img/A01X/partnumbering_e_01.pdf; ComponentLink2Description: http://search.murata.co.jp/Ceramy/image/img/A01X/partnumbering_e_01.pdf; ComponentLink3URL: http://www1.futureelectronics.com/doc/SAMSUNG/CL03A104KQ3NNNC.pdf; ComponentLink3Description: http://www1.futureelectronics.com/doc/SAMSUNG/CL03A104KQ3NNNC.pdf; ComponentLink4URL: https://www.distrelec.biz/Web/Downloads/_e/ng/MLCC_CatalogDownload2013_ENG.pdf?mime=application%2Fpdf; ComponentLink4Description: https://www.distrelec.biz/Web/Downloads/_e/ng/MLCC_CatalogDownload2013_ENG.pdf?mime=application%2Fpdf; ComponentLink5URL: https://www.verical.com/server-webapp/html/getDatasheet?partID=355266; ComponentLink5Description: https://www.verical.com/server-webapp/html/getDatasheet?partID=355266; ComponentLink6URL: http://psearch.murata.com/capacitor/product/GCM155R71H103KA55%23.pdf; ComponentLink6Description: http://psearch.murata.com/capacitor/product/GCM155R71H103KA55%23.pdf; ComponentLink7URL: https://www.verical.com/server-webapp/html/getDatasheet?partID=27433; ComponentLink7Description: https://www.verical.com/server-webapp/html/getDatasheet?partID=27433; ComponentLink8URL: http://psearch.en.murata.com/capacitor/product/GCM155R71H103KA55%23.pdf; ComponentLink8Description: http://psearch.en.murata.com/capacitor/product/GCM155R71H103KA55%23.pdf; ComponentLink9URL: http://search.murata.co.jp/Ceramy/image/img/A01X/partnumbering_e_02.pdf; ComponentLink9Description: http://search.murata.co.jp/Ceramy/image/img/A01X/partnumbering_e_02.pdf; ComponentLink10URL: http://uk.rs-online.com/webdocs/0ef9/0900766b80ef92d0.pdf; ComponentLink10Description: http://uk.rs-online.com/webdocs/0ef9/0900766b80ef92d0.pdf; Stock 1: 100000; Pricing 1: 1=0.34, 10=0.23, 100=0.1163, 500=0.0796, 1000=0.07041, 2500=0.06735, 5000=0.06123 (USD); Mount: Surface Mount; Case/Package: 0402; Weight: 0.000212oz; Case Code (Metric): 1005; Case Code (Imperial): 0402; Min Operating Temperature: -55°C; Max Operating Temperature: 85°C; Packaging: Tape and Reel; Termination: SMD/SMT; Voltage Rating (DC): 25V; Package Quantity: 10000; Length: 0.039inch; Height: 0.5mm; Width: 0.02inch; Thickness: 0.022inch; Supplier 1: Digi-Key
C49 = CAP_4.7uF_0805_25V: as C162 on sheet TPSM846C23_template; Supplier 1: Digi-Key; Stock 1: 10785; Pricing 1: 1=0.25, 10=0.171, 100=0.0867, 500=0.05932, 1000=0.05247 (USD); Mount: Surface Mount; Case/Package: 0805; Case Code (Metric): 2012; Case Code (Imperial): 0805; Min Operating Temperature: -55°C; Max Operating Temperature: 85°C; Package Quantity: 1; Packaging: Tape and Reel; Tolerance: 10%; Voltage Rating: 25V; Dielectric: X5R; Length: 2mm; Height: 0.85mm; Width: 0.049inch; Thickness: 0.037inch; Depth: 1.25mm; Radiation Hardening: No; ComponentLink1URL: http://www.samsungsem.com/kr/support/product-search/mlcc/CL21A475KACLRNC.jsp; ComponentLink1Description: http://www.samsungsem.com/kr/support/product-search/mlcc/CL21A475KACLRNC.jsp; Supplier Part Number 1: 1276-2415-1-ND
J4 J5 J18 = 32K101-400L5: SMA Straight Jack, Up to 18 GHz, -55 to 155 degC; Design Note: Footprint in library is a generic example - only application specific footprint delivers High Performance; DatasheetVersion: a00; PackageVersion: a00; PackageReference: 32K101-400L5; PackageDescription: SMA Straight Jack, 6.35 x 6.35 x 9.5 mm; Mounting Technology: Through Hole; PartNumber: 32K101-400L5; ComponentLink1Description: Manufacturer URL; ComponentLink1URL: http://www.rosenberger.de; ComponentLink2Description: Datasheet; ComponentLink2URL: http://rosenberger.de/ok/images/documents/db/32K101-400L5.pdf; ComponentLink3Description: Package Specification; ComponentLink3URL: http://rosenberger.de/ok/images/documents/db/32K101-400L5.pdf; ComponentLink4Description: Series Overview / Design Note; ComponentLink4URL: http://rosenberger.de/ok/images/documents/spez/32.pdf; ComponentLink5Description: Webshop / RFQ; ComponentLink5URL: http://www.rosenberger.com/en/contact/sales/
X1 = XTAL: Crystal; Manufacturer: Abracon; Manufacturer Part Number: ABS07-120-32.768KHZ-T; Tolerance: 20ppm; Frequency: 32.768kHz; Load Capacitance: 6pF; ESR (Equivalent Series Resistance): 55kR; Series Resistance: 60kR; ComponentLink1URL: https://www.verical.com/server-webapp/html/getDatasheet?partID=722402; ComponentLink1Description: https://www.verical.com/server-webapp/html/getDatasheet?partID=722402; ComponentLink2URL: https://abracon.com/Support/PackageDrawing/Resonators/ABS07-120.PDF; ComponentLink2Description: https://abracon.com/Support/PackageDrawing/Resonators/ABS07-120.PDF; ComponentLink3URL: http://www.mouser.com/ds/2/3/ABS07-120-32.768kHz-T-218607.pdf; ComponentLink3Description: http://www.mouser.com/ds/2/3/ABS07-120-32.768kHz-T-218607.pdf; Stock 1: 222072; Pricing 1: 1=0.57, 10=0.473, 50=0.4258, 100=0.3784, 500=0.35948, 1000=0.30272 (USD); Mount: Surface Mount; Case/Package: SMD/SMT; Number of Pins: 2; Min Operating Temperature: -40°C; Max Operating Temperature: 85°C; Frequency Tolerance: 20ppm; Packaging: Tape and Reel; Package Quantity: 3000; Termination: SMD/SMT; Length: 3.2mm; Height: 0.035inch; Width: 0.061inch; Depth: 1.5mm; Radiation Hardening: No; REACH SVHC: No SVHC; Lead Free: Lead Free; Supplier 1: Digi-Key; Supplier 2: Digi-Key
CLK1 = AD9552: Supplier 1: Digi-Key
S4 = CHS-10TB: Supplier 1: Digi-Key

## Sheet SMA_Banana.SchDoc
size B; Organization: Altium Limited; Address1: L3, 12a Rodborough Rd; Address2: Frenchs Forest; Address3: NSW; Address4: Australia 2086
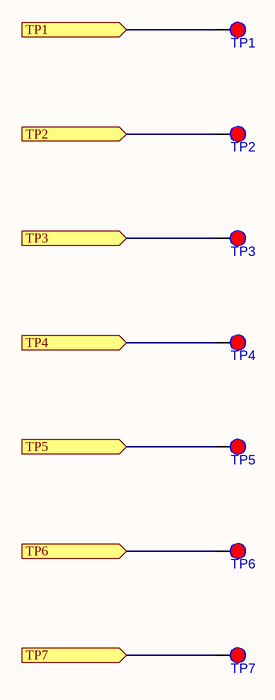
[diagram p14: SMA_Banana.SchDoc]

### Parts
TP1  6.6  [TEST POINT SMALL RED]  (value not drawn)
TP2  6.6  [TEST POINT SMALL RED]  (value not drawn)
TP3  6.6  [TEST POINT SMALL RED]  (value not drawn)
TP4  6.6  [TEST POINT SMALL RED]  (value not drawn)
TP5  6.6  [TEST POINT SMALL RED]  (value not drawn)
TP6  6.6  [TEST POINT SMALL RED]  (value not drawn)
TP7  6.6  [TEST POINT SMALL RED]  (value not drawn)

### Ports
TP1 (in), TP2 (in), TP3 (in), TP4 (in), TP5 (in), TP6 (in), TP7 (in)

### Nets
0V8_OUT: TP6.1 ; port TP6
1V8_OUT: TP1.1 ; port TP1
1V8_PM: TP5.1 ; port TP5
3V3: TP2.1 ; port TP2
5V0: TP3.1 ; port TP3
12V: TP4.1 ; port TP4
GTR_VCC: TP7.1 ; port TP7

### Notes on the sheet
- Title
- Size:
- Date:
- B
- Number:
- Time:
- Revision:
- Sheet
- of
- File:

### Library data of the parts
TP1-TP7 = TEST POINT SMALL RED: Part_Type: HOLE; Mfr Part Number: 5000; Manufacturer: Keystone; Mfr Part Description: TEST POINT PC MINI .040"D RED; ID: 60203; Updated By: murbach; Value: RED; Supplier 1: Digi-Key; Supplier Part Number 1: 36-5000-ND; RoHS: Yes; Created By: murbach; LifeCycle: New; ComponentLink1Description: Datasheets; ComponentLink1URL: http://www.keyelco.com/product-pdf.cfm?p=1309; ComponentLink2Description: Supplier Part Details; ComponentLink2URL: https://www.digikey.com/products/en/test-and-measurement/test-points/616?k=5000K-ND; Created_Date: 2014/11/24 21:28:44; Updated_Date: 2018/06/14 16:57:12; Sub_Type: Test Point

## Sheet RPi_Pico.SchDoc: Raspberry Pi Pico
size A
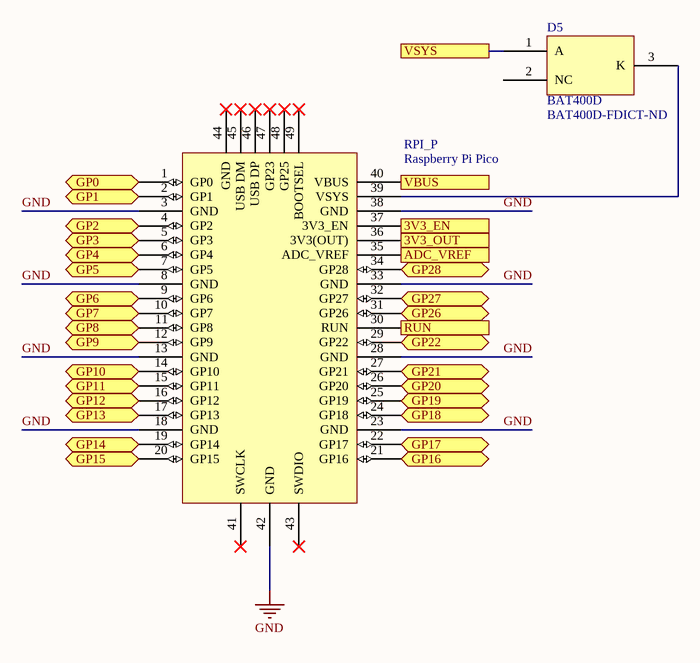
[diagram p15: RPi_Pico.SchDoc]

### Parts
D5  BAT400D  Supplier Part Number 1: BAT400D-FDICT-ND  [SOT95P236X110-3N]
RPI_P  Raspberry Pi Pico  [RPI_PICO]

### Ports
3V3_EN, 3V3_OUT, ADC_VREF (in), GP0 (bidir), GP1 (bidir), GP2 (bidir), GP3 (bidir), GP4 (bidir), GP5 (bidir), GP6 (bidir), GP7 (bidir), GP8 (bidir), GP9 (bidir), GP10 (bidir), GP11 (bidir), GP12 (bidir), GP13 (bidir), GP14 (bidir), GP15 (bidir), GP16 (bidir), GP17 (bidir), GP18 (bidir), GP19 (bidir), GP20 (bidir), GP21 (bidir), GP22 (bidir), GP26 (bidir), GP27 (bidir), GP28 (bidir), RUN (in), VBUS, VSYS

### Nets
5V0: D5.1(A) ; port VSYS
GND: RPI_P.3(GND) RPI_P.8(GND) RPI_P.13(GND) RPI_P.18(GND) RPI_P.23(GND) RPI_P.28(GND) RPI_P.33(GND) RPI_P.38(GND) RPI_P.42(GND)
HDR_PICO_I2C_SCL: RPI_P.7(GP5) ; port GP5
HDR_PICO_I2C_SDA: RPI_P.6(GP4) ; port GP4
nCS: RPI_P.17(GP13) RPI_P.22(GP17) ; port GP13, port GP17
PICO_AC0: RPI_P.31(GP26) ; port GP26
PICO_AC1: RPI_P.32(GP27) ; port GP27
PICO_AC2: RPI_P.34(GP28) ; port GP28
PICO_MASTER_I2C_SCL: RPI_P.10(GP7) ; port GP7
PICO_MASTER_I2C_SDA: RPI_P.9(GP6) ; port GP6
pico_ready: RPI_P.4(GP2) ; port GP2
PICO_RESET_N: RPI_P.30(RUN) ; port RUN
PICO_SPI1_RX: RPI_P.16(GP12) RPI_P.21(GP16) ; port GP12, port GP16
PICO_SPI1_SCK: RPI_P.19(GP14) RPI_P.24(GP18) ; port GP14, port GP18
PICO_SPI1_TX: RPI_P.20(GP15) RPI_P.25(GP19) ; port GP15, port GP19
PICO_UART0_RX: RPI_P.2(GP1) ; port GP1
PICO_UART0_TX: RPI_P.1(GP0) ; port GP0
PICO_UART1_RX: RPI_P.12(GP9) ; port GP9
PICO_UART1_TX: RPI_P.11(GP8) ; port GP8
PMBUS_CNTL: RPI_P.5(GP3) ; port GP3
SOM_PG_OUT: RPI_P.26(GP20) ; port GP20
NetD5_3: D5.3(K) RPI_P.39(VSYS)
NetRPI_P_14: RPI_P.14(GP10) ; port GP10
NetRPI_P_15: RPI_P.15(GP11) ; port GP11
NetRPI_P_27: RPI_P.27(GP21) ; port GP21
NetRPI_P_29: RPI_P.29(GP22) ; port GP22
NetRPI_P_35: RPI_P.35(ADC_VREF) ; port ADC_VREF
NetRPI_P_36: RPI_P.36(3V3(OUT)) ; port 3V3_OUT
NetRPI_P_37: RPI_P.37(3V3_EN) ; port 3V3_EN
NetRPI_P_40: RPI_P.40(VBUS) ; port VBUS

Not connected (* = marked no-connect by the designer): D5 2(NC); RPI_P 41(SWCLK)* 43(SWDIO)* 44(GND)* 45(USB_DM)* 46(USB_DP)* 47(GP23)* 48(GP25)* 49(BOOTSEL)*

### Library data of the parts
D5 = BAT400D: Supplier 1: Digi-Key

## Nets that join several sheets
0V8_OUT: Power_subsystem (S3.2 S3.5), SMA_Banana (TP6.1)
1V8_OUT: Top (14 pins), Ultrascale_EG (D2.1 JTAG1.9), Power_subsystem (S2.2 S2.5), SMA_Banana (TP1.1)
1V8_PM: Top (R44.1 R54.1 R55.1), Ultrascale_EG2 (J8.36 J8.42), Ultrascale_EG (6 pins), Ultrascale_EG3 (6 pins), Power_subsystem (S1.2 S1.5), SMA_Banana (TP5.1)
3V3: Ultrascale_EG2 (J8.67), Ultrascale_EG (JTAG1.11), ETH_microSD (7 pins), Display_port (12 pins), Power_subsystem (11 pins), CSI_connectors (18 pins), Ref_CLK (8 pins), SMA_Banana (TP2.1)
5V0: USB (5 pins), Power_subsystem (7 pins), SMA_Banana (TP3.1), RPi_Pico (D5.1)
12V: Ultrascale_EG (J9.132 J9.133 J9.140), Ultrascale_EG3 (J15.132 J15.133 J15.140), Power_subsystem (7 pins), U_Power_subsystem/U_TPSM846C23_template (9 pins), U_Power_subsystem/U_TPSM846C23_template (9 pins), SMA_Banana (TP4.1)
GND: Top (18 pins), Ultrascale_EG2 (23 pins), Ultrascale_EG (46 pins), Ultrascale_EG3 (31 pins), USB (10 pins), ETH_microSD (13 pins), Display_port (24 pins), Power_subsystem (21 pins), U_Power_subsystem/U_TPSM846C23_template (27 pins), U_Power_subsystem/U_TPSM846C23_template (27 pins), CSI_connectors (22 pins), Ref_CLK (25 pins), RPi_Pico (9 pins)
0V8_INT: Power_subsystem (S3.1 S3.4), U_Power_subsystem/U_TPSM846C23_template (13 pins)
1V5_VBATT: Ultrascale_EG2 (J8.46), Power_subsystem (U10.5)
1V8_PSM_INT: Power_subsystem (S1.1 S1.4), U_Power_subsystem/U_TPSM846C23_template (13 pins)
ALERT0: Top (J16.2), U_Power_subsystem/U_TPSM846C23_template (U7_U_Power_subsystem_U_TPSM846C23_template#1.20)
ALERTIO: Top (J16.1), U_Power_subsystem/U_TPSM846C23_template (U7_U_Power_subsystem_U_TPSM846C23_template#2.20)
CAM0_C_N: Ultrascale_EG (J9.65), CSI_connectors (J11.8)
CAM0_C_P: Ultrascale_EG (J9.63), CSI_connectors (J11.7)
CAM0_D0_N: Ultrascale_EG (J9.11), CSI_connectors (J11.14)
CAM0_D0_P: Ultrascale_EG (J9.9), CSI_connectors (J11.13)
CAM0_D1_N: Ultrascale_EG (J9.17), CSI_connectors (J11.11)
CAM0_D1_P: Ultrascale_EG (J9.15), CSI_connectors (J11.10)
CAM1_C_N: Ultrascale_EG (J9.69), CSI_connectors (J12.8)
CAM1_C_P: Ultrascale_EG (J9.71), CSI_connectors (J12.7)
CAM1_D0_N: Ultrascale_EG (J9.29), CSI_connectors (J12.14)
CAM1_D0_P: Ultrascale_EG (J9.27), CSI_connectors (J12.13)
CAM1_D1_N: Ultrascale_EG (J9.23), CSI_connectors (J12.11)
CAM1_D1_P: Ultrascale_EG (J9.21), CSI_connectors (J12.10)
cc_fpga_i2c_scl: Top (HDR1.15), Ultrascale_EG2 (J8.44)
cc_fpga_i2c_sda: Top (HDR1.9), Ultrascale_EG2 (J8.41)
cgra_clk: Ultrascale_EG3 (J15.128), Ref_CLK (J4.1)
dp_jtag_tck: Top (J7.7), Ultrascale_EG (J9.131)
dp_jtag_tdi: Top (J7.9), Ultrascale_EG (J9.125)
dp_jtag_tdo: Top (J7.8), Ultrascale_EG (J9.122)
dp_jtag_tms: Top (J7.5), Ultrascale_EG (J9.129)
dp_jtag_trstn: Top (J7.6), Ultrascale_EG (J9.124)
ETH_MD1_N: Ultrascale_EG2 (J8.59), ETH_microSD (J2.3)
ETH_MD1_P: Ultrascale_EG2 (J8.57), ETH_microSD (J2.1)
ETH_MD2_N: Ultrascale_EG2 (J8.58), ETH_microSD (J2.6)
ETH_MD2_P: Ultrascale_EG2 (J8.56), ETH_microSD (J2.4)
ETH_MD3_N: Ultrascale_EG2 (J8.65), ETH_microSD (J2.9)
ETH_MD3_P: Ultrascale_EG2 (J8.63), ETH_microSD (J2.7)
ETH_MD4_N: Ultrascale_EG2 (J8.64), ETH_microSD (J2.12)
ETH_MD4_P: Ultrascale_EG2 (J8.62), ETH_microSD (J2.10)
FPGA_CGRA_RESET_N: Top (HDR1.1), Ultrascale_EG3 (J15.136)
fpga_i2c_scl: Top (HDR1.13), Ultrascale_EG3 (J15.131)
fpga_i2c_sda: Top (HDR1.11), Ultrascale_EG3 (J15.129)
GTR_TX2_N: Ultrascale_EG2 (J8.9), Display_port (C136.1)
GTR_TX2_P: Ultrascale_EG2 (J8.7), Display_port (C135.1)
GTR_TX3_N: Ultrascale_EG2 (J8.3), Display_port (C134.1)
GTR_TX3_P: Ultrascale_EG2 (J8.1), Display_port (C133.1)
GTR_VCC: Ultrascale_EG2 (J8.31 J8.37 J8.39), Power_subsystem (U11.5), SMA_Banana (TP7.1)
HDR_PICO_I2C_SCL: Top (HDR1.14 HDR1.16 J16.7 R43.2), CSI_connectors (R50.1 U9.18), RPi_Pico (RPI_P.7)
HDR_PICO_I2C_SDA: Top (HDR1.10 HDR1.12 J16.9 R40.2), CSI_connectors (R51.1 U9.19), RPi_Pico (RPI_P.6)
LED1: Top (DS4.2), Ultrascale_EG (J9.123)
LED2: Top (DS5.2), Ultrascale_EG (J9.118)
LED3: Top (DS6.2), Ultrascale_EG (J9.116)
nCS: Ref_CLK (CLK1.12), RPi_Pico (RPI_P.17 RPI_P.22)
NetDS2_2: Power_subsystem (DS2.2), U_Power_subsystem/U_TPSM846C23_template (R41_U_Power_subsystem_U_TPSM846C23_template#1.2 U7_U_Power_subsystem_U_TPSM846C23_template#1.52)
NetDS3_2: Power_subsystem (DS3.2), U_Power_subsystem/U_TPSM846C23_template (R41_U_Power_subsystem_U_TPSM846C23_template#2.2 U7_U_Power_subsystem_U_TPSM846C23_template#2.52)
NetJ1_1: Ultrascale_EG2 (J8.97), ETH_microSD (J1.1)
NetJ1_2: Ultrascale_EG2 (J8.98), ETH_microSD (J1.2)
NetJ1_3: Ultrascale_EG2 (J8.99), ETH_microSD (J1.3 R21.1)
NetJ1_7: Ultrascale_EG2 (J8.95), ETH_microSD (J1.7)
NetJ1_8: Ultrascale_EG2 (J8.96), ETH_microSD (J1.8)
NetJ1_10: Ultrascale_EG2 (J8.94), ETH_microSD (J1.10 R25.1)
NetJ8_52: Ultrascale_EG2 (J8.52), ETH_microSD (R27.1)
NetJ8_53: Ultrascale_EG2 (J8.53), ETH_microSD (R30.1)
NetJ8_70: Ultrascale_EG2 (J8.70), Display_port (R15.2)
NetJ8_71: Ultrascale_EG2 (J8.71), Display_port (R8.1)
NetJ8_72: Ultrascale_EG2 (J8.72), Display_port (R14.2)
NetJ8_73: Ultrascale_EG2 (J8.73), Display_port (R16.2)
NetJ8_93: Ultrascale_EG2 (J8.93), ETH_microSD (R20.1 R22.1)
NetJ8_100: Ultrascale_EG2 (J8.100), ETH_microSD (R23.1)
NetR33_2: Power_subsystem (R33.2), U_Power_subsystem/U_TPSM846C23_template (U7_U_Power_subsystem_U_TPSM846C23_template#1.16)
NetR34_2: Power_subsystem (R34.2), U_Power_subsystem/U_TPSM846C23_template (U7_U_Power_subsystem_U_TPSM846C23_template#1.17)
NetR36_2: Power_subsystem (R36.2), U_Power_subsystem/U_TPSM846C23_template (U7_U_Power_subsystem_U_TPSM846C23_template#2.16)
NetR37_2: Power_subsystem (R37.2), U_Power_subsystem/U_TPSM846C23_template (U7_U_Power_subsystem_U_TPSM846C23_template#2.17)
PICO_MASTER_I2C_SCL: Top (J16.3 R39.2), U_Power_subsystem/U_TPSM846C23_template (U7_U_Power_subsystem_U_TPSM846C23_template#1.19), U_Power_subsystem/U_TPSM846C23_template (U7_U_Power_subsystem_U_TPSM846C23_template#2.19), RPi_Pico (RPI_P.10)
PICO_MASTER_I2C_SDA: Top (J16.5 R38.2), U_Power_subsystem/U_TPSM846C23_template (U7_U_Power_subsystem_U_TPSM846C23_template#1.18), U_Power_subsystem/U_TPSM846C23_template (U7_U_Power_subsystem_U_TPSM846C23_template#2.18), RPi_Pico (RPI_P.9)
pico_ready: Ultrascale_EG3 (J15.130), RPi_Pico (RPI_P.4)
PICO_RESET_N: Top (SW3.1 SW3.2), RPi_Pico (RPI_P.30)
PICO_SPI1_SCK: Ref_CLK (CLK1.13), RPi_Pico (RPI_P.19 RPI_P.24)
PICO_SPI1_TX: Ref_CLK (CLK1.14), RPi_Pico (RPI_P.20 RPI_P.25)
PMBUS_CNTL: Top (J16.8), U_Power_subsystem/U_TPSM846C23_template (R42_U_Power_subsystem_U_TPSM846C23_template#1.2 U7_U_Power_subsystem_U_TPSM846C23_template#1.12), U_Power_subsystem/U_TPSM846C23_template (R42_U_Power_subsystem_U_TPSM846C23_template#2.2 U7_U_Power_subsystem_U_TPSM846C23_template#2.12), RPi_Pico (RPI_P.5)
SOM_PG_OUT: Ultrascale_EG3 (J15.41), RPi_Pico (RPI_P.26)
SOM_RESET_IN_N: Top (SW1.1 SW1.2), Ultrascale_EG3 (J15.42)
USB3_D_N: Ultrascale_EG2 (J8.47), USB (R45.1)
USB3_D_P: Ultrascale_EG2 (J8.45), USB (R46.1)